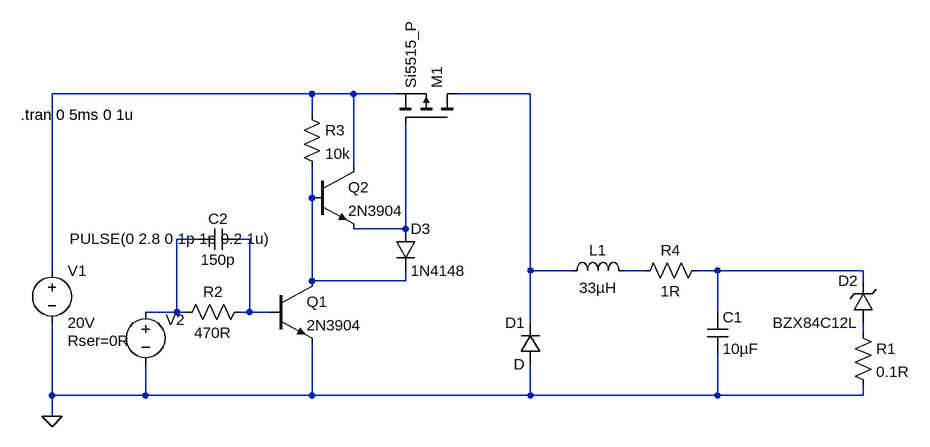
[diagram p0: schematic sim_bucket_2.asc]
sim_bucket_2.asc, the LTspice schematic file:
Version 4
SHEET 1 1024 680
WIRE -32 -176 -432 -176
WIRE 32 -176 -32 -176
WIRE 96 -176 32 -176
WIRE 304 -176 192 -176
WIRE -32 -144 -32 -176
WIRE 32 -64 32 -176
WIRE -32 -16 -32 -64
WIRE 112 32 112 -128
WIRE 112 32 32 32
WIRE -208 48 -240 48
WIRE -128 48 -144 48
WIRE -432 96 -432 -176
WIRE 304 96 304 -176
WIRE 368 96 304 96
WIRE 480 96 448 96
WIRE 592 96 560 96
WIRE 816 96 592 96
WIRE -32 112 -32 -16
WIRE 112 112 112 96
WIRE 112 112 -32 112
WIRE 816 112 816 96
WIRE -240 160 -240 48
WIRE -240 160 -288 160
WIRE -224 160 -240 160
WIRE -128 160 -128 48
WIRE -128 160 -144 160
WIRE -96 160 -128 160
WIRE 592 160 592 96
WIRE 304 176 304 96
WIRE 816 192 816 176
WIRE -432 288 -432 176
WIRE -288 288 -288 240
WIRE -288 288 -432 288
WIRE -32 288 -32 208
WIRE -32 288 -288 288
WIRE 304 288 304 240
WIRE 304 288 -32 288
WIRE 592 288 592 224
WIRE 592 288 304 288
WIRE 816 288 816 272
WIRE 816 288 592 288
WIRE -432 320 -432 288
FLAG -432 320 0
SYMBOL voltage -432 80 R0
WINDOW 123 0 0 Left 2
WINDOW 39 24 124 Left 2
SYMATTR SpiceLine Rser=0R
SYMATTR InstName V1
SYMATTR Value 20V
SYMBOL cap 576 160 R0
SYMATTR InstName C1
SYMATTR Value 10µF
SYMBOL ind 352 112 R270
WINDOW 0 32 56 VTop 2
WINDOW 3 5 56 VBottom 2
SYMATTR InstName L1
SYMATTR Value 33µH
SYMBOL zener 832 176 R180
WINDOW 0 24 64 Left 2
WINDOW 3 24 0 Left 2
SYMATTR InstName D2
SYMATTR Value BZX84C12L
SYMATTR Description Light Emitting Diode
SYMATTR Type led
SYMBOL res 800 176 R0
SYMATTR InstName R1
SYMATTR Value 0.1R
SYMBOL npn -96 112 R0
SYMATTR InstName Q1
SYMATTR Value 2N3904
SYMBOL pmos 192 -128 M270
SYMATTR InstName M1
SYMATTR Value Si5515_P
SYMBOL res -128 144 R90
WINDOW 0 0 56 VBottom 2
WINDOW 3 32 56 VTop 2
SYMATTR InstName R2
SYMATTR Value 470R
SYMBOL cap -144 32 R90
WINDOW 0 0 32 VBottom 2
WINDOW 3 32 32 VTop 2
SYMATTR InstName C2
SYMATTR Value 150p
SYMBOL voltage -288 144 R0
WINDOW 3 -117 -97 Left 2
WINDOW 123 0 0 Left 2
WINDOW 39 0 0 Left 2
WINDOW 0 31 28 Left 2
SYMATTR Value PULSE(0 2.8 0 1p 1p 0.2 1u)
SYMATTR InstName V2
SYMBOL res -48 -160 R0
SYMATTR InstName R3
SYMATTR Value 10k
SYMBOL npn -32 -64 R0
SYMATTR InstName Q2
SYMATTR Value 2N3904
SYMBOL diode 96 32 R0
SYMATTR InstName D3
SYMATTR Value 1N4148
SYMBOL res 576 80 R90
WINDOW 0 0 56 VBottom 2
WINDOW 3 32 56 VTop 2
SYMATTR InstName R4
SYMATTR Value 1R
SYMBOL diode 320 240 R180
WINDOW 0 24 64 Left 2
WINDOW 3 24 0 Left 2
SYMATTR InstName D1
TEXT -480 -144 Left 2 !.tran 0 5ms 0 1u

The netlist it stands for:
* sim_bucket_2.asc
V1 N001 0 20V Rser=0R
C1 N008 0 10µF
L1 N002 N007 33µH
D2 N009 N008 BZX84C12L
R1 N009 0 0.1R
Q1 N003 N006 0 0 2N3904
M1 N002 N004 N001 N001 Si5515_P
R2 N006 N005 470R
C2 N006 N005 150p
V2 N005 0 PULSE(0 2.8 0 1p 1p 0.2 1u)
R3 N001 N003 10k
Q2 N001 N003 N004 0 2N3904
D3 N004 N003 1N4148
R4 N008 N007 1R
D1 0 N002 D
.model D D
.lib standard.dio
.model NPN NPN
.model PNP PNP
.lib standard.bjt
.model NMOS NMOS
.model PMOS PMOS
.lib standard.mos
.tran 0 5ms 0 1u
.backanno
.end